# EAGLE design layout (EAGLE 6.5.0)
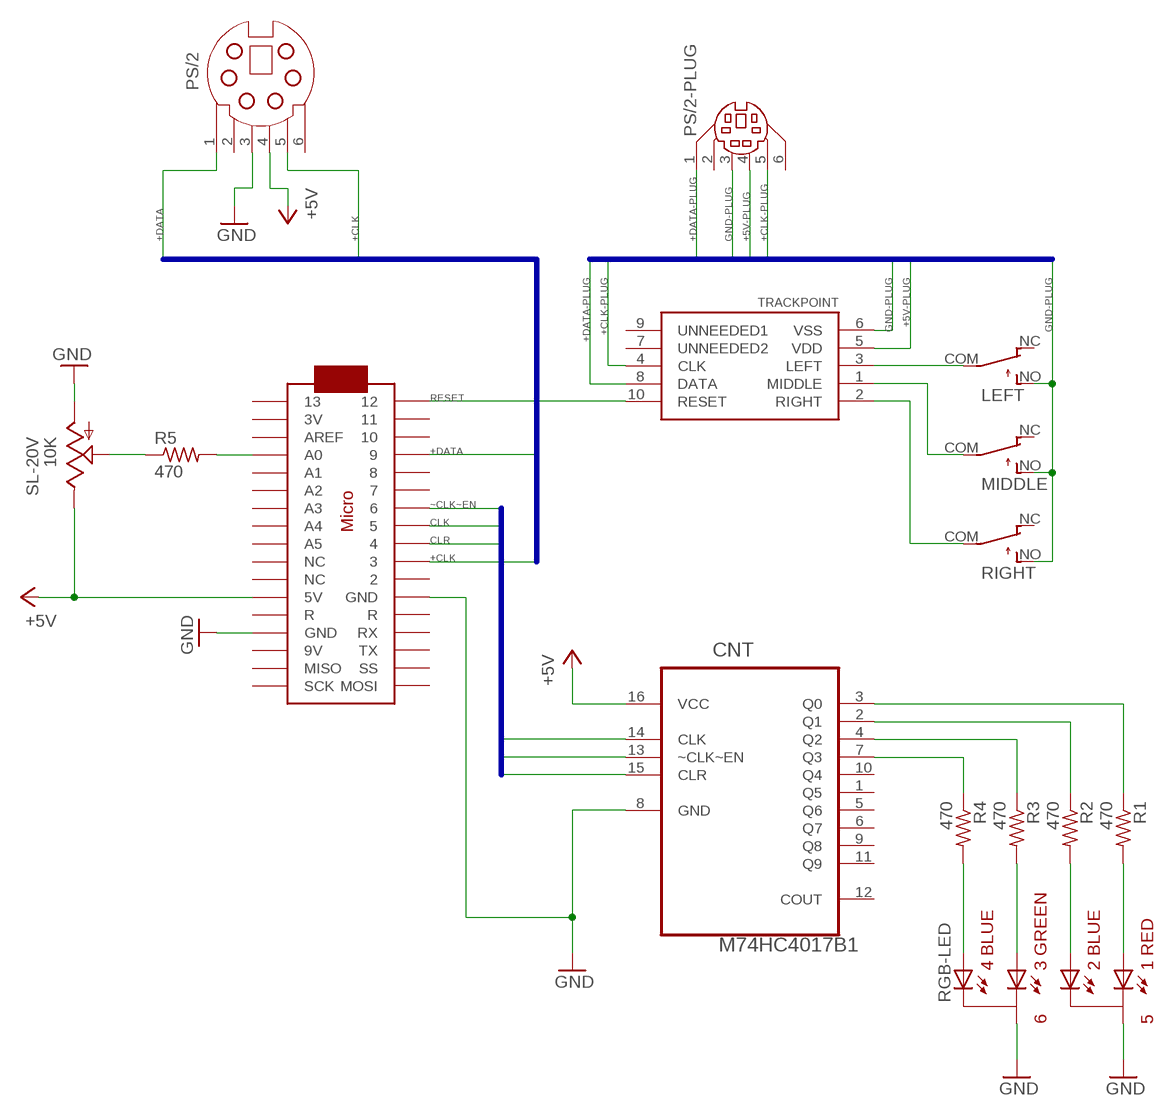
[diagram p0: schematic, sheet 1]

## Parts
CNT  M74HC4017B1  M74HC4017B1R  [DIP254P762X510-16]
PS/2  MDSSV-BC06  [SSV-BC06]
PS/2-PLUG  MDIN06K  [MDIN06K]
R1  470  R-US_0207/10  [0207/10]
R2  470  R-US_0207/10  [0207/10]
R3  470  R-US_0207/10  [0207/10]
R4  470  R-US_0207/10  [0207/10]
R5  470  R-US_0207/10  [0207/10]
RGB-LED  RGBLED  [RGBLED5MM]
TRACKPOINT  BOARD  [BOARD]
U$1  LEFT  D2F  [D2F]
U$2  ARDUINOMICRO  [ARDUINOMICRO]
U$3  MIDDLE  D2F  [D2F]
U$5  RIGHT  D2F  [D2F]
U$6  10K  SL-20V  [SL-20V]

## Nets
+5V: CNT.16(VCC) PS/2.4 U$2.P$23(5V) U$6.4(E)
+5V-PLUG: PS/2-PLUG.4 TRACKPOINT.5(VDD)
+CLK: PS/2.5 U$2.P$10
+CLK-PLUG: PS/2-PLUG.5 TRACKPOINT.4(CLK)
+DATA: PS/2.1 U$2.P$4
+DATA-PLUG: PS/2-PLUG.1 TRACKPOINT.8(DATA)
CLK: CNT.14(CLK) U$2.P$8
CLR: CNT.15(CLR) U$2.P$9
GND: CNT.8(GND) PS/2.3 RGB-LED.C5 RGB-LED.C6 U$2.P$12(GND) U$2.P$21(GND) U$6.1(A)
GND-PLUG: PS/2-PLUG.3 TRACKPOINT.6(VSS) U$1.NO(S) U$3.NO(S) U$5.NO(S)
LED: R4.2 RGB-LED.A4_BLUE
LEFT: TRACKPOINT.3(LEFT) U$1.COM(P)
N$1: CNT.2(Q1) R2.1
N$2: CNT.3(Q0) R1.1
N$3: CNT.4(Q2) R3.1
N$4: CNT.7(Q3) R4.1
N$5: R5.2 U$2.P$31(A0)
N$6: R3.2 RGB-LED.A3_GREEN
N$7: R2.2 RGB-LED.A2_BLUE
N$8: R1.2 RGB-LED.A1_RED
N$10: TRACKPOINT.1(MIDDLE) U$3.COM(P)
N$11: TRACKPOINT.2(RIGHT) U$5.COM(P)
N$12: R5.1 U$6.2(S) U$6.3(S)
RESET: TRACKPOINT.10(RESET) U$2.P$1
~CLK~EN: CNT.13(~CLK~EN) U$2.P$7
Unconnected: CNT.1(Q5) CNT.5(Q6) CNT.6(Q7) CNT.9(Q8) CNT.10(Q4) CNT.11(Q9) CNT.12(COUT) PS/2-PLUG.2 PS/2-PLUG.6 PS/2.2 PS/2.6 TRACKPOINT.7(UNNEEDED2) TRACKPOINT.9(UNNEEDED1) U$1.NC(O) U$2.P$2 U$2.P$3 U$2.P$5 U$2.P$6 U$2.P$11 U$2.P$13(R) U$2.P$14(RX) U$2.P$15(TX) U$2.P$16(SS) U$2.P$17(MOSI) U$2.P$18(SCK) U$2.P$19(MISO) U$2.P$20(9V) U$2.P$22(R) U$2.P$24(NC) U$2.P$25(NC) U$2.P$26(A5) U$2.P$27(A4) U$2.P$28(A3) U$2.P$29(A2) U$2.P$30(A1) U$2.P$32(AREF) U$2.P$33(3V) U$2.P$34 U$3.NC(O) U$5.NC(O)

## Buses
CLK,~CLK~EN,CLR
+DATA,+CLK
+DATA-PLUG,+CLK-PLUG,GND-PLUG,+5V-PLUG

## Library data of the parts
CNT = ST Microelctronics_By_element14_Batch_1:M74HC4017B1R: DECADE COUNTER/DIVIDER; MPN: M74HC4017B1R; OC_FARNELL: 1094301; OC_NEWARK: 89K0898; PACKAGE: PDIP-16; SUPPLIER: STMICROELECTRONICS
PS/2 = con-yamaichi:MDSSV-BC06: YAMAICHI CONNECTOR; OC_FARNELL: unknown; OC_NEWARK: unknown
PS/2-PLUG = con-yamaichi:MDIN06K: YAMAICHI CONNECTOR; OC_FARNELL: unknown; OC_NEWARK: unknown
R1-R5 = rcl:R-US_: RESISTOR, American symbol
RGB-LED = rgb_led:RGBLED
TRACKPOINT = library:BOARD: TrackPoint board with cable broken off
U$1 U$3 U$5 = library:D2F: Omron D2F switch
U$2 = adafruit:ARDUINOMICRO
U$6 = library:SL-20V: Song Huei SL-20V

## Board
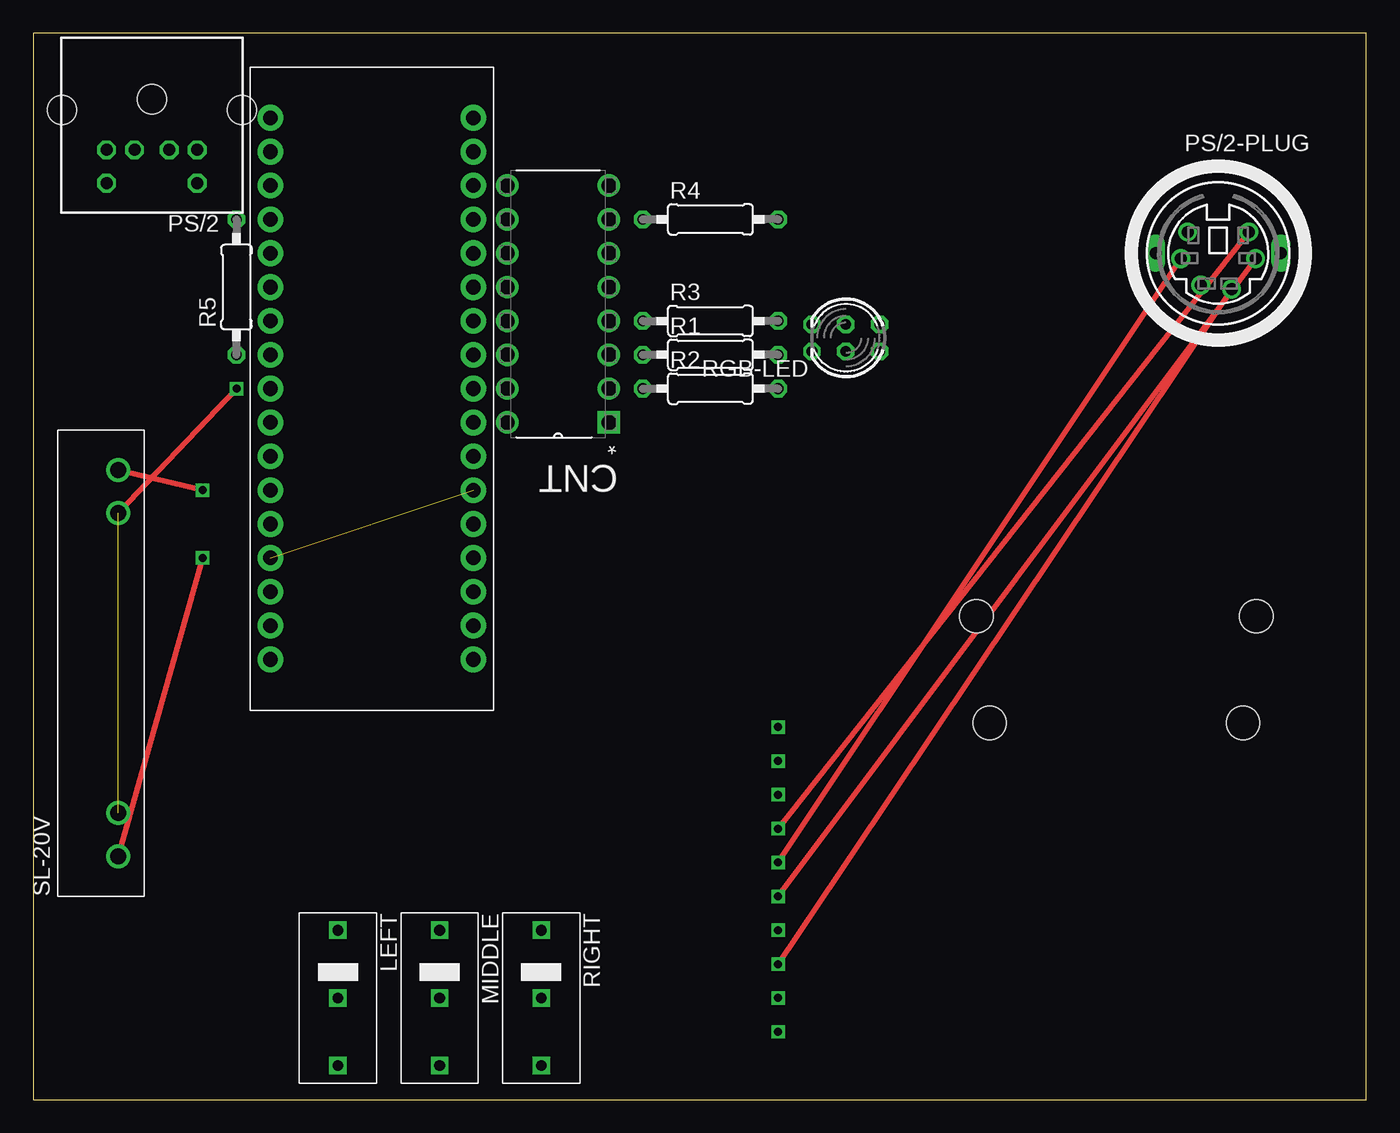
[diagram p1: board, top side]
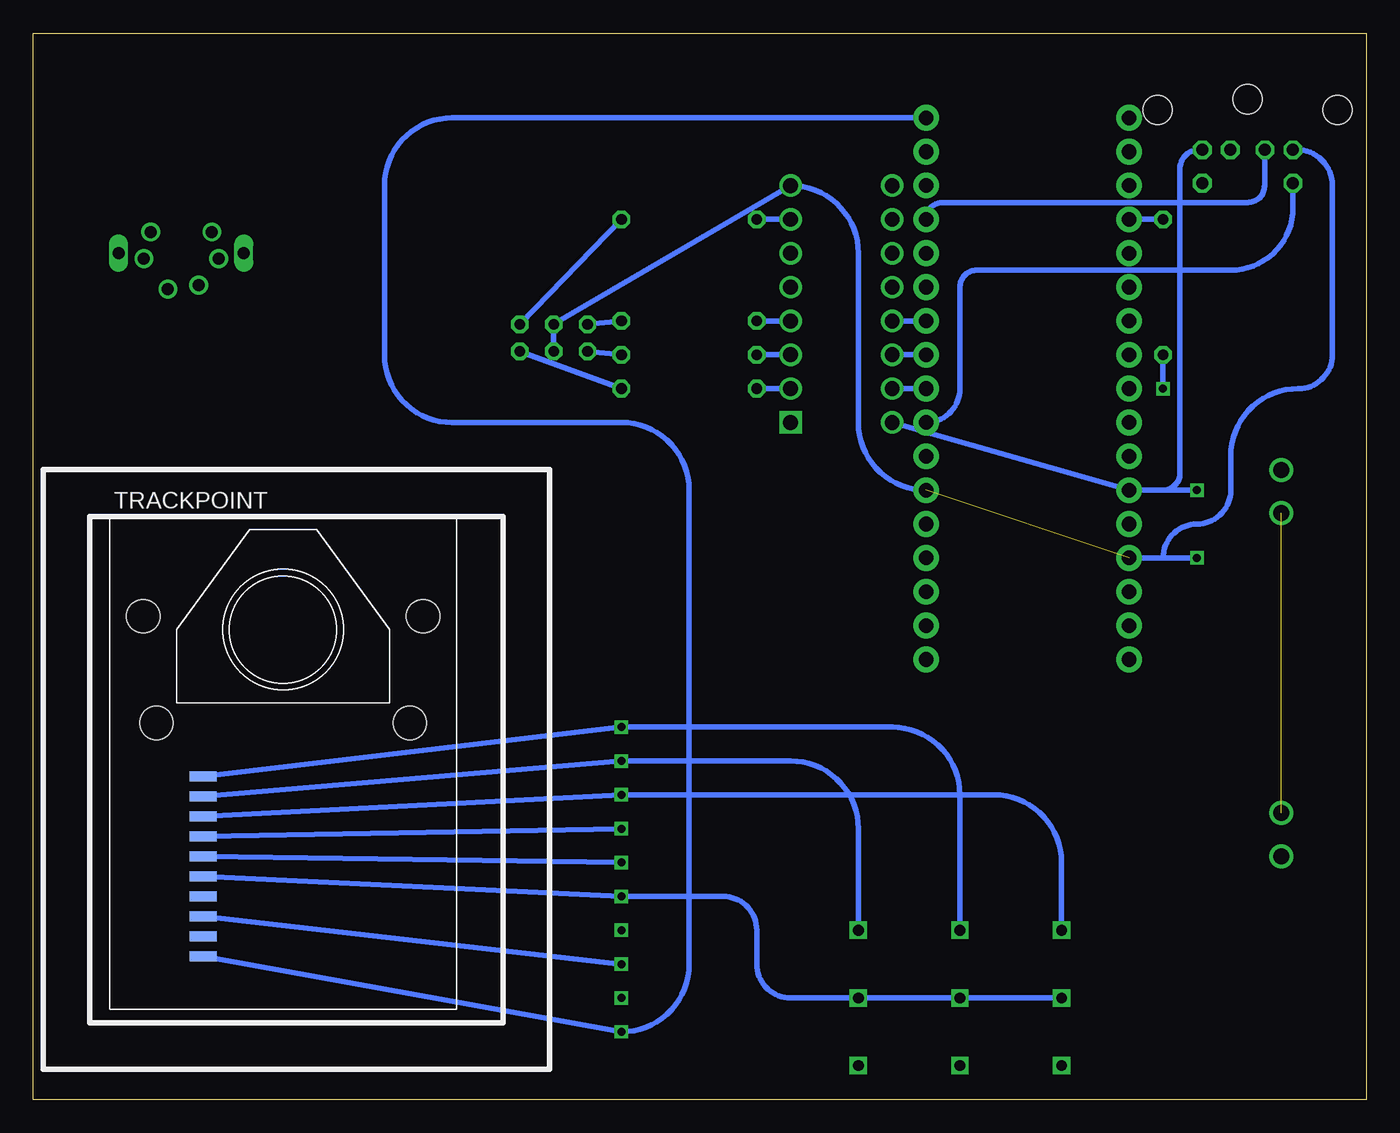
[diagram p2: board, bottom side, seen from below]

Size 100 x 80 mm. Coordinates in mm from the lower left corner, seen from the top.
Outline: 0,0 100,0 100,80 0,80 0,0
Copper layers (1*16): Top 0.035mm / dielectric 1.5mm / Bottom 0.035mm
Design rules "default": minimum track width 10mil, minimum drill 24mil, track to track 8mil, track to pad 8mil, pad to pad 8mil, via to via 8mil, smd to smd 8mil, copper to edge 40mil, drill to drill 8mil, minimum pad ring 10mil, minimum via ring 8mil, stop-mask expansion 4mil, vias tented up to drill 0mil, thermal gap 10mil

### Footprints (pad centres in the part's own frame; a part is rotated, then mirrored left to right if it is on the bottom)
DIP254P762X510-16 = drill 1.118 square: 1 -7.62,17.78 | drill 1.118: 2 -7.62,15.24; 3 -7.62,12.7; 4 -7.62,10.16; 5 -7.62,7.62; 6 -7.62,5.08; 7 -7.62,2.54; 8 -7.62,0; 9 0,0; 10 0,2.54; 11 0,5.08; 12 0,7.62; 13 0,10.16; 14 0,12.7; 15 0,15.24; 16 0,17.78
SSV-BC06 = drill 0.9 octagon: 1 1.3,8.5; 2 -1.3,8.5; 3 3.4,8.5; 4 -3.4,8.5; 5 3.4,11; 6 -3.4,11 | hole 2.2: -6.75,5.5; 0,4.7; 6.75,5.5
MDIN06K = drill 0.9: 1 1,-2.7; 2 -1.3,-2.4; 3 2.8,-0.4; 4 -2.8,-0.4; 5 2.3,1.6; 6 -2.3,1.6 | drill 0.9 long: M1 -4.7,0; M2 4.7,0
0207/10 = drill 0.813 octagon: 1 -5.08,0; 2 5.08,0
RGBLED5MM = drill 0.8 octagon: A1_RED 2.54,1.016; A2_BLUE -2.54,1.016; A3_GREEN 2.54,-1.016; A4_BLUE -2.54,-1.016; C5 0,1.016; C6 0,-1.016
BOARD = smd 2 x 0.75: 1 -6,-1; 2 -6,-2.5; 3 -6,-4; 4 -6,-5.5; 5 -6,-7; 6 -6,-8.5; 7 -6,-10; 8 -6,-11.5; 9 -6,-13; 10 -6,-14.5 | hole 2.5: -10.5,11; -9.5,3; 10.5,11; 9.5,3
D2F = drill 0.8 square: COM -5.08,0; NC 5.08,0; NO 0,0
ARDUINOMICRO = drill 1.1 pad 1.93: P$1 -20.32,7.62; P$2 -17.78,7.62; P$3 -15.24,7.62; P$4 -12.7,7.62; P$5 -10.16,7.62; P$6 -7.62,7.62; P$7 -5.08,7.62; P$8 -2.54,7.62; P$9 0,7.62; P$10 2.54,7.62; P$11 5.08,7.62; P$12 12.7,-7.62; P$13 10.16,-7.62; P$14 12.7,7.62; P$15 15.24,7.62; P$16 17.78,7.62; P$17 20.32,7.62; P$18 20.32,-7.62; P$19 17.78,-7.62; P$20 15.24,-7.62; P$21 7.62,7.62; P$22 10.16,7.62; P$23 7.62,-7.62; P$24 5.08,-7.62; P$25 2.54,-7.62; P$26 0,-7.62; P$27 -2.54,-7.62; P$28 -5.08,-7.62; P$29 -7.62,-7.62; P$30 -10.16,-7.62; P$31 -12.7,-7.62; P$32 -15.24,-7.62; P$33 -17.78,-7.62; P$34 -20.32,-7.62
SL-20V = drill 1.2: 1 3,-1.3; 2 6.25,-1.3; 3 28.75,-1.3; 4 32,-1.3

### Placement (x,y rotation side)
CNT  35.56,68.58 180 top
PS/2  8.89,79.76 180 top
PS/2-PLUG  88.9,63.5 0 top
R1  50.8,55.88 0 top
R2  50.8,53.34 0 top
R3  50.8,58.42 0 top
R4  50.8,66.04 0 top
R5  15.24,60.96 90 top
RGB-LED  60.96,57.15 180 top
TRACKPOINT  81.26,25.26 0 bottom
U$1  22.86,7.62 270 top
U$2  25.4,53.34 270 top
U$3  30.48,7.62 270 top
U$5  38.1,7.62 270 top
U$6  5.08,15.24 90 top

### Tracks (layer width: path | path; a pad name or v marks a point on that pad's centre or on a via)
+5V  (via drill 0.6)
  Top 0.406: U$6.4 v12.7,45.72
  Bottom 0.406: v12.7,45.72 15.24,45.72 | 15.24,45.72 U$2.P$23 CNT.16 | PS/2.4 12.56,71.26 arc-90 13.97,69.85 13.97,46.99 arc90 15.24,45.72
+5V-PLUG  (via drill 0.6)
  Top 0.406: PS/2-PLUG.4 v55.88,17.78
  Bottom 0.406: v55.88,17.78 TRACKPOINT.5
+CLK
  Bottom 0.406: PS/2.5 5.49,66.9 arc90 10.16,62.23 29.21,62.23 arc-90 30.48,60.96 30.48,53.34 arc90 U$2.P$10
+CLK-PLUG  (via drill 0.6)
  Top 0.406: v55.88,20.32 PS/2-PLUG.5
  Bottom 0.406: v55.88,20.32 TRACKPOINT.4
+DATA
  Bottom 0.406: PS/2.1 arc-90 7.62,71.23 7.62,68.58 arc90 8.89,67.31 31.75,67.31 arc-90 U$2.P$4
+DATA-PLUG  (via drill 0.6)
  Top 0.406: v55.88,10.16 PS/2-PLUG.1
  Bottom 0.406: v55.88,10.16 TRACKPOINT.8
CLK
  Bottom 0.406: U$2.P$8 CNT.14
CLR
  Bottom 0.406: U$2.P$9 CNT.15
GND  (via drill 0.6)  (1 unrouted)
  Top 0.406: v12.7,40.64 U$6.1
  Bottom 0.406: RGB-LED.C5 RGB-LED.C6 CNT.8 arc90 38.1,63.5 38.1,50.8 arc-90 U$2.P$21 | U$2.P$12 15.24,40.64 | 15.24,40.64 v12.7,40.64 | 15.24,40.64 arc90 12.7,43.18 arc-90 10.16,45.72 10.16,48.26 arc90 5.08,53.34 arc-90 2.54,55.88 2.54,68.58 arc-96 PS/2.3
GND-PLUG  (via drill 0.6)
  Top 0.406: PS/2-PLUG.3 v55.88,15.24
  Bottom 0.406: TRACKPOINT.6 v55.88,15.24 48.26,15.24 arc90 45.72,12.7 45.72,10.16 arc-90 43.18,7.62 U$5.NO U$3.NO U$1.NO
LED
  Bottom 0.406: R4.2 RGB-LED.A4_BLUE
LEFT
  Bottom 0.406: TRACKPOINT.3 55.88,22.86 27.94,22.86 arc90 22.86,17.78 U$1.COM
N$1
  Bottom 0.406: CNT.2 R2.1
N$2
  Bottom 0.406: CNT.3 R1.1
N$3
  Bottom 0.406: CNT.4 R3.1
N$4
  Bottom 0.406: CNT.7 R4.1
N$5
  Bottom 0.406: R5.2 U$2.P$31
N$6
  Bottom 0.406: R3.2 RGB-LED.A3_GREEN
N$7
  Bottom 0.406: R2.2 RGB-LED.A2_BLUE
N$8
  Bottom 0.406: R1.2 RGB-LED.A1_RED
N$10
  Bottom 0.406: TRACKPOINT.1 55.88,27.94 35.56,27.94 arc90 30.48,22.86 U$3.COM
N$11
  Bottom 0.406: TRACKPOINT.2 55.88,25.4 43.18,25.4 arc90 38.1,20.32 U$5.COM
N$12  (via drill 0.6)  (1 unrouted)
  Top 0.406: U$6.3 v15.24,53.34
  Bottom 0.406: R5.1 v15.24,53.34
N$14  (via drill 0.6)
  other vias: 55.88,5.08
N$15  (via drill 0.6)
  other vias: 55.88,7.62
N$16  (via drill 0.6)
  other vias: 55.88,10.16
N$17  (via drill 0.6)
  other vias: 55.88,12.7
N$18  (via drill 0.6)
  other vias: 55.88,15.24
N$19  (via drill 0.6)
  other vias: 55.88,17.78
N$20  (via drill 0.6)
  other vias: 55.88,20.32
N$21  (via drill 0.6)
  other vias: 55.88,22.86
N$22  (via drill 0.6)
  other vias: 55.88,25.4
N$24  (via drill 0.6)
  other vias: 55.88,27.94
RESET
  Bottom 0.406: TRACKPOINT.10 55.88,5.08 arc-90 50.8,10.16 50.8,45.72 arc-90 55.88,50.8 68.58,50.8 arc90 73.66,55.88 73.66,68.58 arc90 68.58,73.66 U$2.P$1
~CLK~EN
  Bottom 0.406: U$2.P$7 CNT.13